# Altium schematic sheet Sheet1.SchDoc
size A; SheetNumber: 1; SheetTotal: 1
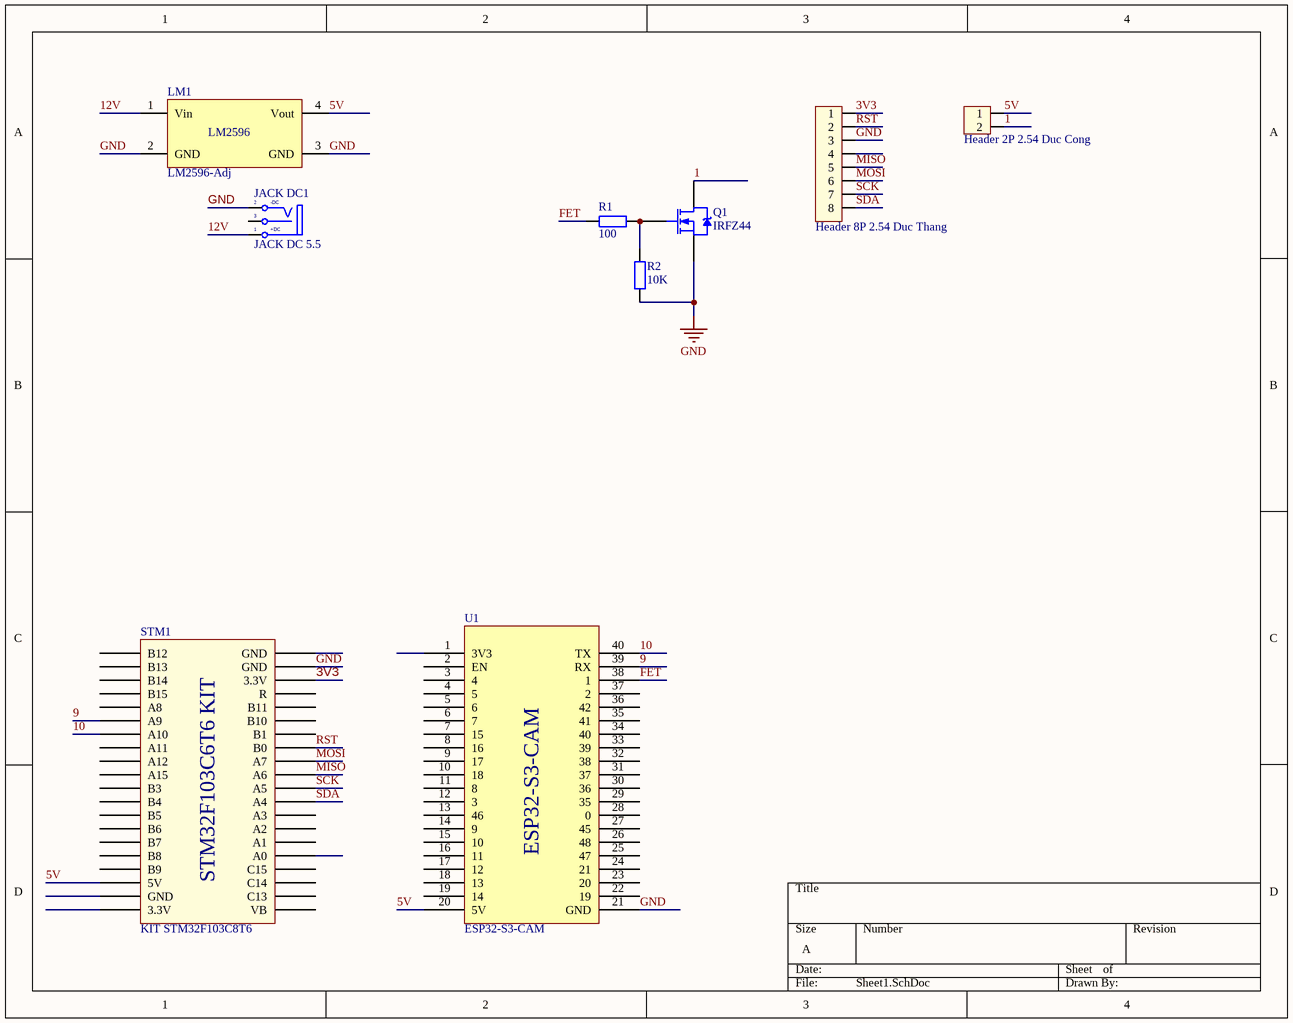
[diagram p0: Sheet1.SchDoc]

## Parts
H1  Header 8P 2.54 Duc Thang  [XH2.54M-8]
H2  Header 2P 2.54 Duc Cong  [Header 2P DC 2.54]
JACK_DC1  JACK DC 5.5  [JACK DC 5.5]
LM1  LM2596-Adj  [lm2596]
Q1  IRFZ44  [QTO-220H3]
R1  100  [R1/4W]
R2  10K  [R1/4W]
STM1  KIT STM32F103C8T6  [STM32F103 KIT]
U1  ESP32-S3-CAM  [ESP32-S3-CAM]

## Nets
GND: H1.3 JACK_DC1.2(TN) LM1.2(GND) LM1.3(GND) Q1.3(S) R2.1 STM1.39(GND) U1.21(GND)
1: H2.2 Q1.2(D)
3V3: H1.1 STM1.38(3.3V)
5V: H2.1 LM1.4(Vout) STM1.18(5V) U1.20(5V)
9: STM1.6(A9) U1.39(RX)
10: STM1.7(A10) U1.40(TX)
12V: JACK_DC1.1(T) LM1.1(Vin)
FET: R1.1 U1.38(1)
MISO: H1.5 STM1.31(A6)
MOSI: H1.6 STM1.32(A7)
RST: H1.2 STM1.33(B0)
SCK: H1.7 STM1.30(A5)
SDA: H1.8 STM1.29(A4)
NetQ1_1: Q1.1(G) R1.2 R2.2

Not connected (* = marked no-connect by the designer): H1 4; JACK_DC1 3(S); STM1 1(B12) 2(B13) 3(B14) 4(B15) 5(A8) 8(A11) 9(A12) 10(A15) 11(B3) 12(B4) 13(B5) 14(B6) 15(B7) 16(B8) 17(B9) 19(GND) 20(3.3V) 21(VB) 22(C13) 23(C14) 24(C15) 25(A0) 26(A1) 27(A2) 28(A3) 34(B1) 35(B10) 36(B11) 37(R) 40(GND); U1 1(3V3) 2(EN) 3(4) 4(5) 5(6) 6(7) 7(15) 8(16) 9(17) 10(18) 11(8) 12(3) 13(46) 14(9) 15(10) 16(11) 17(12) 18(13) 19(14) 22(19) 23(20) 24(21) 25(47) 26(48) 27(45) 28(0) 29(35) 30(36) 31(37) 32(38) 33(39) 34(40) 35(41) 36(42) 37(2)

## Notes on the sheet
- (in symbol JACK DC 5.5) -DC; +DC
- (in symbol LM2596-Adj) LM2596
- (in symbol STM32f103 Bluepill) STM32F103C6T6 KIT

## Library data of the parts
H1 = Header 8P 2.54 Duc Thang: Cắm; Ten_Linh_Kien: Header 8P XH2.54-8P Đực Thẳng; Don_Vi: Con; Ma_Hang: MH003366; Chung_Loai: Cắm
H2 = Header 2P 2.54 Duc Cong: Cắm; Ten_Linh_Kien: Header 2P XH2.54-2P Đực Cong; Don_Vi: Con; Ma_Hang: MH002852; Chung_Loai: Cắm
JACK_DC1 = JACK DC 5.5: Value: Jac DC
LM1 = LM2596-Adj: Designed By @Alixahedi
Q1 = IRFZ44: HEXFET N-Channel Power MOSFET
R1 R2 = R1/4W: Resistor 1/4W; Value: R1/4W - 1K
STM1 = STM32f103 Bluepill: KIT STM32F103C8T6 Bluepill